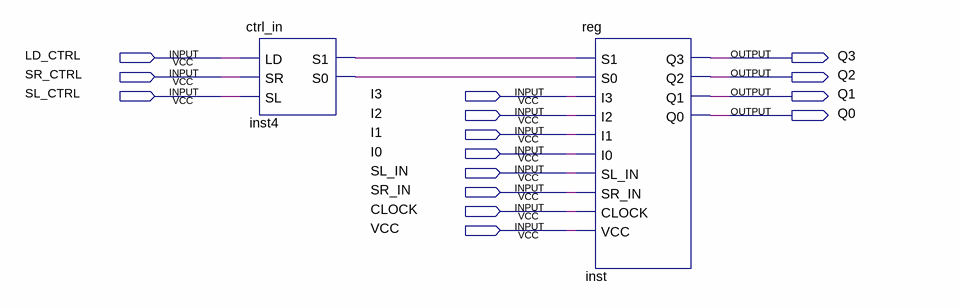
[diagram p0: schematic sheet]
// Quartus schematic reg_mult.bdf as structural Verilog: 2 symbols, 15 pins
module reg_mult (
  input  LD_CTRL,
  input  SR_CTRL,
  input  SL_CTRL,
  input  I3,
  input  I2,
  input  I1,
  input  I0,
  input  SL_IN,
  input  SR_IN,
  input  CLOCK,
  input  VCC,
  output Q3,
  output Q2,
  output Q1,
  output Q0
);

  wire inst4_s0, inst4_s1;

  ctrl_in inst4 (.LD(LD_CTRL), .SR(SR_CTRL), .SL(SL_CTRL), .S1(inst4_s1), .S0(inst4_s0));
  \reg  inst (
    .S1(inst4_s1), .S0(inst4_s0), .I3(I3), .I2(I2), .I1(I1), .I0(I0), .SL_IN(SL_IN), .SR_IN(SR_IN),
    .CLOCK(CLOCK), .VCC(VCC), .Q3(Q3), .Q2(Q2), .Q1(Q1), .Q0(Q0));
endmodule
